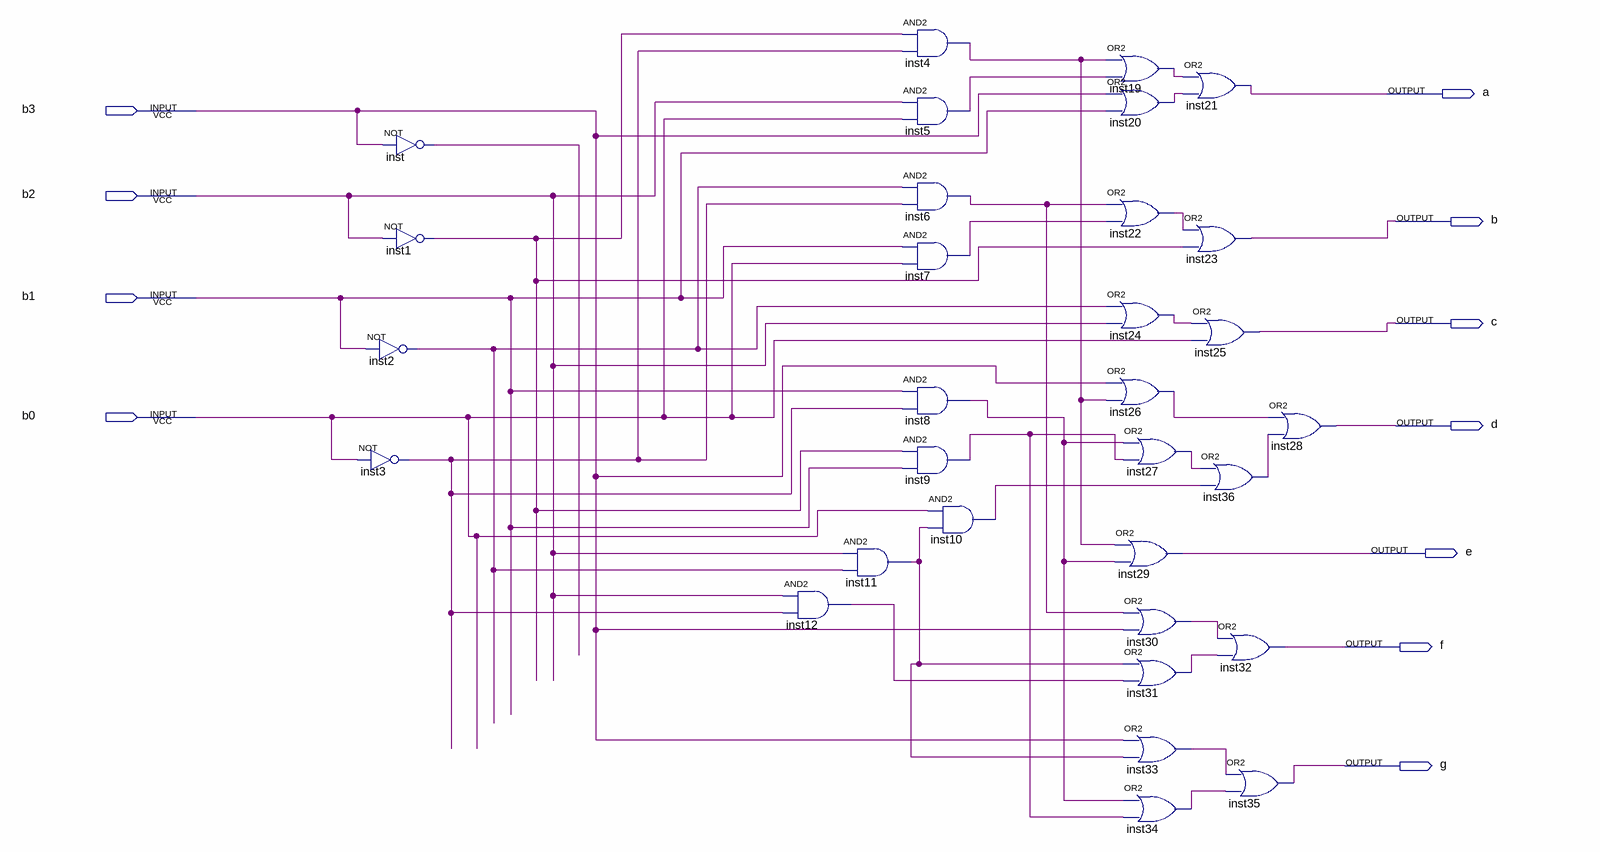
[diagram p0: schematic sheet]
// Quartus schematic binary_to_7segment.bdf as structural Verilog: 31 symbols, 11 pins
module binary_to_7segment (
  input  b3,
  input  b2,
  input  b1,
  input  b0,
  output a,
  output b,
  output c,
  output d,
  output e,
  output f,
  output g
);

  wire inst1_out, inst2_out, inst3_out, inst4_out, inst5_out, inst6_out, inst7_out, inst8_out, inst9_out,
       inst10_out, inst11_out, inst12_out, inst19_out, inst20_out, inst22_out, inst24_out, inst26_out,
       inst27_out, inst30_out, inst31_out, inst33_out, inst34_out, inst36_out, inst_out;

  not inst2 (inst2_out, b1);
  not inst3 (inst3_out, b0);
  not inst (inst_out, b3);
  not inst1 (inst1_out, b2);
  and inst11 (inst11_out, b2, inst2_out);
  and inst12 (inst12_out, b2, inst3_out);
  and inst4 (inst4_out, inst1_out, inst3_out);
  and inst5 (inst5_out, b2, b0);
  and inst6 (inst6_out, inst2_out, inst3_out);
  and inst7 (inst7_out, b1, b0);
  and inst8 (inst8_out, b1, inst3_out);
  and inst9 (inst9_out, inst1_out, b1);
  and inst10 (inst10_out, b0, inst11_out);
  or inst19 (inst19_out, inst4_out, inst5_out);
  or inst20 (inst20_out, b3, b1);
  or inst22 (inst22_out, inst6_out, inst7_out);
  or inst24 (inst24_out, inst2_out, b2);
  or inst26 (inst26_out, b3, inst4_out);
  or inst29 (e, inst4_out, inst8_out);
  or inst21 (a, inst19_out, inst20_out);
  or inst23 (b, inst22_out, inst1_out);
  or inst27 (inst27_out, inst8_out, inst9_out);
  or inst30 (inst30_out, inst6_out, b3);
  or inst31 (inst31_out, inst11_out, inst12_out);
  or inst33 (inst33_out, b3, inst11_out);
  or inst34 (inst34_out, inst8_out, inst9_out);
  or inst25 (c, inst24_out, b0);
  or inst36 (inst36_out, inst27_out, inst10_out);
  or inst32 (f, inst30_out, inst31_out);
  or inst35 (g, inst33_out, inst34_out);
  or inst28 (d, inst26_out, inst36_out);
endmodule
